# EAGLE design LAMPU_EMERGENCY_v1.3_all_module_smd (EAGLE 9.6.1)
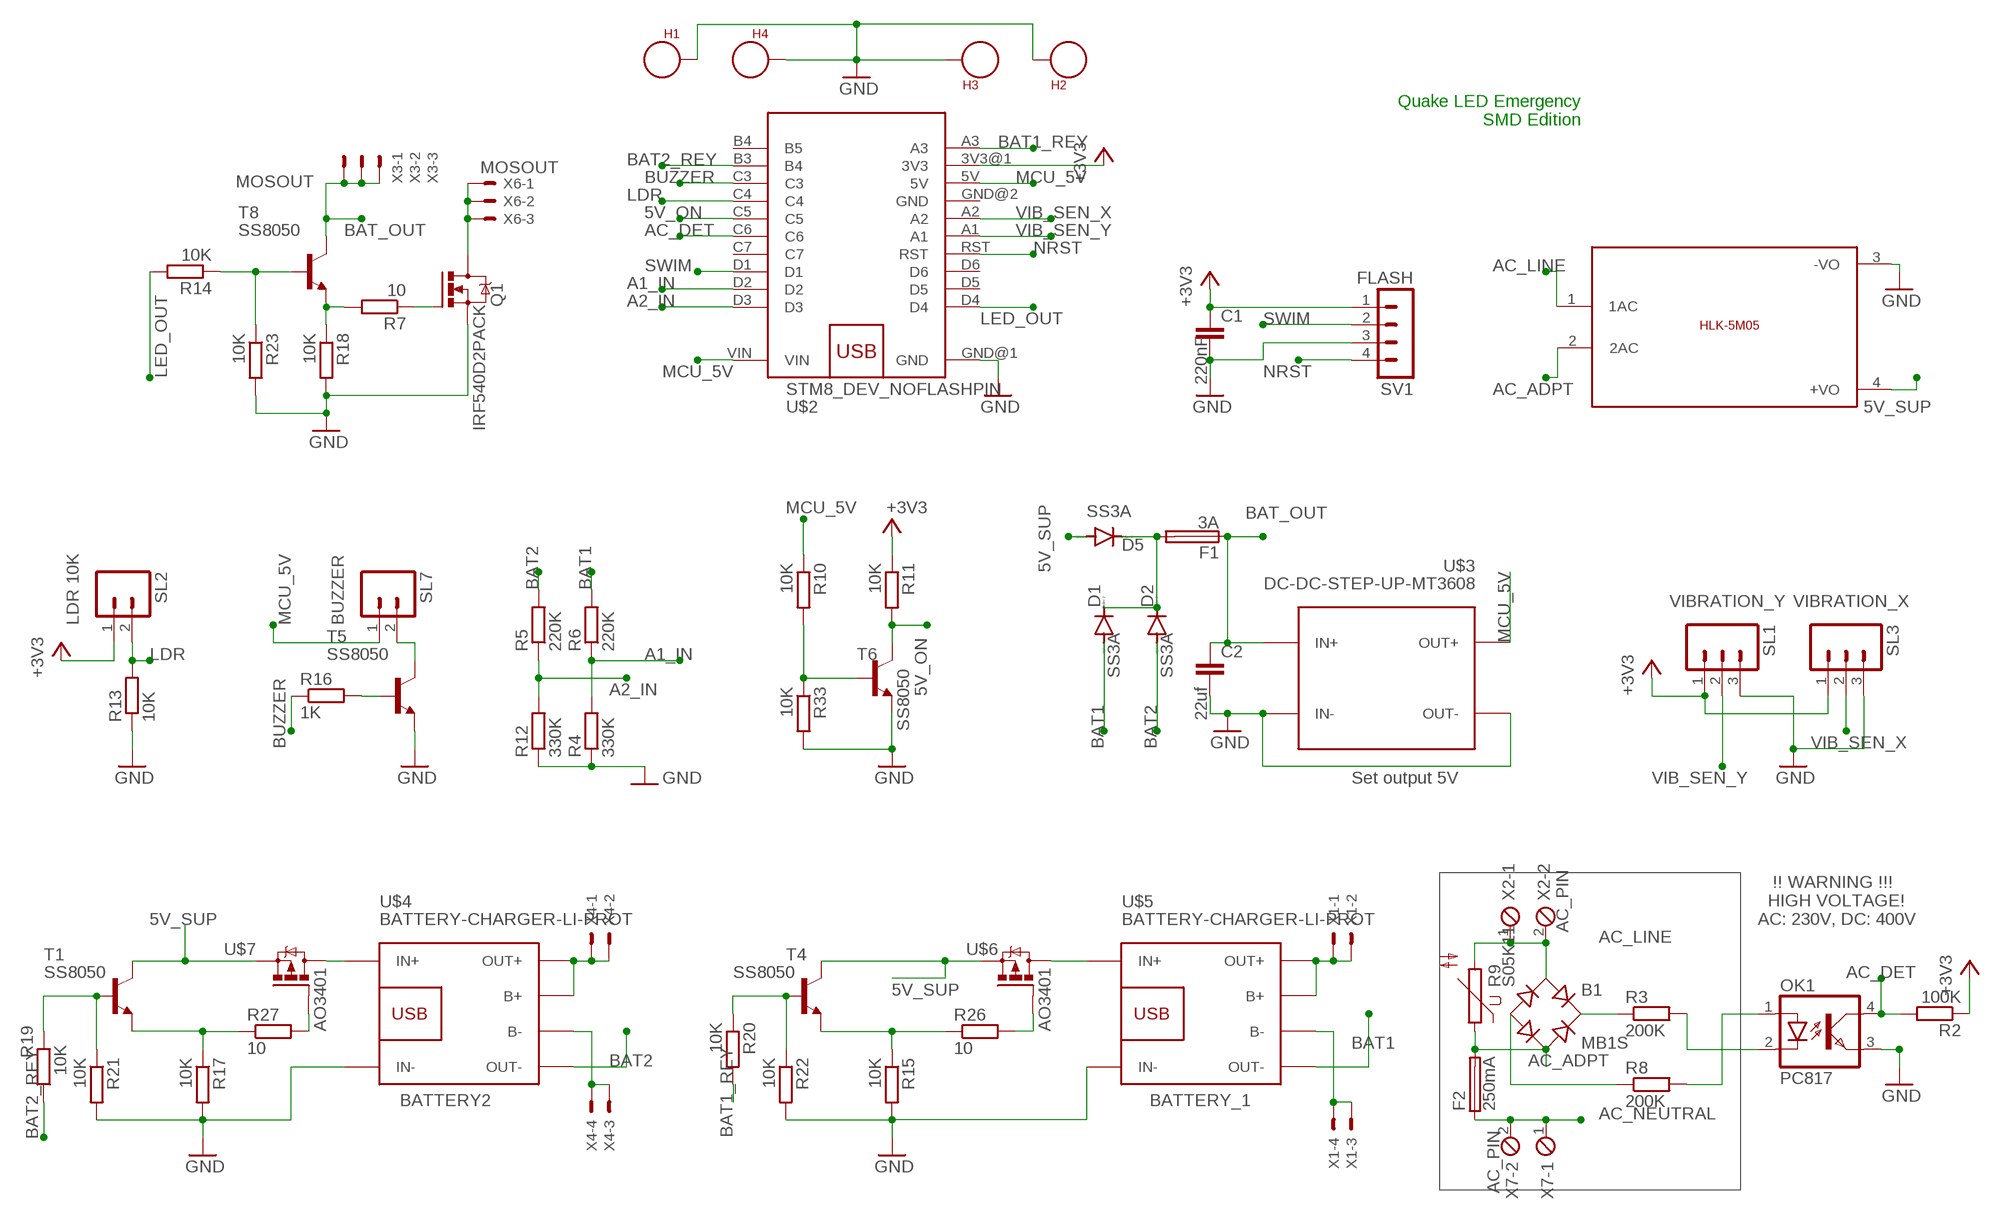
[diagram p0: schematic, sheet 1]

## Parts
B1  MB1S  [SOIC-4]
C1  220nF  C-EUC0805K  [C0805K]
C2  22uf  C-EUC0805K  [C0805K]
D1  SS3A  ES2D  [SMB]
D2  SS3A  ES2D  [SMB]
D5  SS3A  ES2D  [SMB]
F1  3A  FUSEGSH15  [GSH15]
F2  250mA  TR5  [TR5]
H1  SEW_HOLE  [SIMPLE_HOLE]
H2  SEW_HOLE  [SIMPLE_HOLE]
H3  SEW_HOLE  [SIMPLE_HOLE]
H4  SEW_HOLE  [SIMPLE_HOLE]
OK1  PC817  [DIL04]
Q1  IRF540D2PACK  [D2PACK]
R2  100K  R-EU_M1206  [M1206]
R3  200K  R-EU_0922V  [0922V]
R4  330K  R-EU_M1206  [M1206]
R5  220K  R-EU_M1206  [M1206]
R6  220K  R-EU_M1206  [M1206]
R7  10  R-EU_M1206  [M1206]
R8  200K  R-EU_0922V  [0922V]
R9  S05K11  [S05K11]
R10  10K  R-EU_M1206  [M1206]
R11  10K  R-EU_M1206  [M1206]
R12  330K  R-EU_M1206  [M1206]
R13  10K  R-EU_M1206  [M1206]
R14  10K  R-EU_M1206  [M1206]
R15  10K  R-EU_M1206  [M1206]
R16  1K  R-EU_M1206  [M1206]
R17  10K  R-EU_M1206  [M1206]
R18  10K  R-EU_M1206  [M1206]
R19  10K  R-EU_M1206  [M1206]
R20  10K  R-EU_M1206  [M1206]
R21  10K  R-EU_M1206  [M1206]
R22  10K  R-EU_M1206  [M1206]
R23  10K  R-EU_M1206  [M1206]
R26  10  R-EU_M1206  [M1206]
R27  10  R-EU_M1206  [M1206]
R33  10K  R-EU_M1206  [M1206]
SL1  VIBRATION_Y  M03  [03P]
SL2  LDR 10K  M02  [02P]
SL3  VIBRATION_X  M03  [03P]
SL7  BUZZER  M02  [02P]
SV1  FLASH  MA04-1  [MA04-1]
T1  SS8050  BC846  [SOT23]
T4  SS8050  BC846  [SOT23]
T5  SS8050  BC846  [SOT23]
T6  SS8050  BC846  [SOT23]
T8  SS8050  BC846  [SOT23]
U$1  5VDC/5W  HLK-5M05  [HLK-5M05]
U$2  STM8_DEV_NOFLASHPIN  [NO_FLASH_PIN]
U$3  DC-DC-STEP-UP-MT3608  [DC-DC-STEP-UP-MT3608]
U$4  BATTERY-CHARGER-LI-PROT  [BATTERY-CHARGER-LI-PROT]
U$5  BATTERY-CHARGER-LI-PROT  [BATTERY-CHARGER-LI-PROT]
U$6  AO3401  [SOT23]
U$7  AO3401  [SOT23]
X1  BATTERY_1  22-23-2041  [22-23-2041]
X2  AC_PIN  MPT2  [2POL254]
X3  MOSOUT  22-23-2031  [22-23-2031]
X4  BATTERY2  22-23-2041  [22-23-2041]
X6  MOSOUT  22-23-2031  [22-23-2031]
X7  AC_PIN  MPT2  [2POL254]

## Nets
5V_ON: R11.2 T6.3(C) U$2.C5
5V_SUP: D5.A T1.3(C) T4.3(C) U$1.4(+VO) U$6.3(S) U$7.3(S)
+3V3: C1.1 R2.1 R11.1 SL1.1 SL2.1 SL3.1 SV1.1 U$2.3V3@1(3V3)
A1_IN: R4.2 R6.1 U$2.D2
A2_IN: R5.1 R12.2 U$2.D3
AC_ADPT: B1.~2(AC2) F2.2 R9.1 U$1.2(2AC)
AC_DET: OK1.4(COL) R2.2 U$2.C6
AC_LINE: B1.~1(AC1) R9.2 U$1.1(1AC) X2.1 X2.2
AC_NEUTRAL: F2.1 X7.1 X7.2
BAT1: D1.A R6.2 U$5.OUT-
BAT1_REY: R20.2 U$2.A3
BAT2: D2.A R5.2 U$4.OUT-
BAT2_REY: R19.1 U$2.B3(B4)
BAT_OUT: C2.1 F1.1 T8.3(C) U$3.IN+ X3.1 X3.2 X3.3
BUZZER: R16.1 U$2.C3
GND: C1.2 C2.2 H1.P$1 H2.P$1 H3.P$1 H4.P$1 OK1.3(EMIT) Q1.3(S) R4.1 R12.1 R13.1 R15.2 R17.2 R18.2 R21.2 R22.2 R23.2 R33.2 SL1.3 SL3.3 SV1.3 T5.2(E) T6.2(E) U$1.3(-VO) U$2.GND@1(GND) U$3.IN- U$3.OUT- U$4.IN- U$5.IN-
LDR: R13.2 SL2.2 U$2.C4
LED_OUT: R14.2 U$2.D4
MCU_5V: R10.1 SL7.1 U$2.5V U$2.VIN U$3.OUT+
N$1: OK1.2(C) R3.2
N$2: R10.2 R33.1 T6.1(B)
N$3: B1.+ R3.1
N$4: B1.- R8.1
N$5: OK1.1(A) R8.2
N$6: U$4.B+ U$4.OUT+ X4.1 X4.2
N$8: Q1.1(G) R7.1
N$9: R26.2 U$6.1(G)
N$10: U$5.IN+ U$6.2(D)
N$11: U$4.B- X4.3 X4.4
N$13: U$5.B+ U$5.OUT+ X1.1 X1.2
N$14: R15.1 R26.1 T4.2(E)
N$15: SL7.2 T5.3(C)
N$16: R27.2 U$7.1(G)
N$17: D1.C D2.C D5.C F1.2
N$18: R16.2 T5.1(B)
N$19: U$5.B- X1.3 X1.4
N$20: R19.2 R21.1 T1.1(B)
N$21: R7.2 R18.1 T8.2(E)
N$23: R14.1 R23.1 T8.1(B)
N$24: Q1.2(D) X6.1 X6.2 X6.3
N$26: R17.1 R27.1 T1.2(E)
N$29: R20.1 R22.1 T4.1(B)
N$39: U$4.IN+ U$7.2(D)
NRST: SV1.4 U$2.RST
SWIM: SV1.2 U$2.D1
VIB_SEN_X: SL3.2 U$2.A2
VIB_SEN_Y: SL1.2 U$2.A1
Unconnected: U$2.B4(B5) U$2.C7 U$2.D5 U$2.D6

## Notes on the sheet
- Quake LED Emergency
         SMD Edition
- Set output 5V
- !! WARNING !!!
    HIGH VOLTAGE!
  AC: 230V, DC: 400V

## Power pins joined to a net without a drawn wire
GND: U$2.GND@2(GND)

## Library data of the parts
B1 = rectifier:MB*S: Bridge Rectifier Source: http://www.fairchildsemi.com/ds/MB/MB6S.pdf
C1 C2 = rcl:C-EU: CAPACITOR, European symbol; SPICEPREFIX: C
D1 D2 D5 = diode:ES2D: DIODE super fast rectifier, 2 A
F1 = fuse:FUSE: Fuse; OC_FARNELL: unknown; OC_NEWARK: unknown
F2 = fuse:TR5: FUSE Wickmann; OC_FARNELL: unknown; OC_NEWARK: unknown
H1-H4 = LilyPad-Wearables:SEW_HOLE: Simple sew-hole .1" diameter hole with 20mil annular ring
OK1 = optocoupler:PC817: SHARP OPTO COUPLER; MPN: PC817X4J000F; OC_FARNELL: 9707727; OC_NEWARK: 97K7059; SPICEPREFIX: O
Q1 = transistor-power:IRF540: HEXFET Power MOSFET
R2-R8 R10-R23 R26 R27 R33 = rcl:R-EU_: RESISTOR, European symbol; SPICEPREFIX: R
R9 = varistor:S05K11: VARISTOR
SL1 SL3 = con-amp-quick:M03: AMP QUICK CONNECTOR; OC_FARNELL: unknown; OC_NEWARK: unknown
SL2 SL7 = con-amp-quick:M02: AMP QUICK CONNECTOR; OC_FARNELL: unknown; OC_NEWARK: unknown
SV1 = con-lstb:MA04-1: PIN HEADER; OC_FARNELL: unknown; OC_NEWARK: unknown
T1 T4-T6 T8 = transistor:BC846: NPN TRANSISTOR
U$1 = HLK-5M05:HLK-5M05: HLK-5M05 is an 5Volt/5W smps developed by HI-LINK; SIZE: 23x38(mm)
U$2 = STM8-blue:STM8_DEV_NOFLASHPIN
U$3 = diy-modules:DC-DC-STEP-UP-MT3608: DC/DC Step-Up Regulator based on MT3608 chip MT3608 datasheet available here: https://www.olimex.com/Products/Breadboarding/BB-PWR-3608/resources/MT3608.pdf Click here to find device on ebay.com <http://www.ebay.com/sch/mt3608+module>
U$4 U$5 = diy-modules:BATTERY-CHARGER-LI-PROT: Lithium Battery 5V Charger with protection circuit More details available here: http://www.instructables.com/id/DIY-Lithium-ion-Battery-Charger/step4/TP4056-based-lithium-ion-battery-charger-module/ Click here to find device on ebay.com <http://www.ebay.com/sch/tp4056+charger+usb+protection>
U$6 U$7 = transistor-power:AO3401
X1 X4 = con-molex:22-23-2041: .100" (2.54mm) Center Header - 4 Pin; MF: MOLEX; MPN: 22-23-2041; OC_FARNELL: 1462920; OC_NEWARK: 38C0355
X2 X7 = con-phoenix-254:MPT2: PHOENIX CONNECTOR; OC_FARNELL: unknown; OC_NEWARK: unknown
X3 X6 = con-molex:22-23-2031: .100" (2.54mm) Center Header - 3 Pin; MF: MOLEX; MPN: 22-23-2031; OC_FARNELL: 1462950; OC_NEWARK: 30C0862

## Board
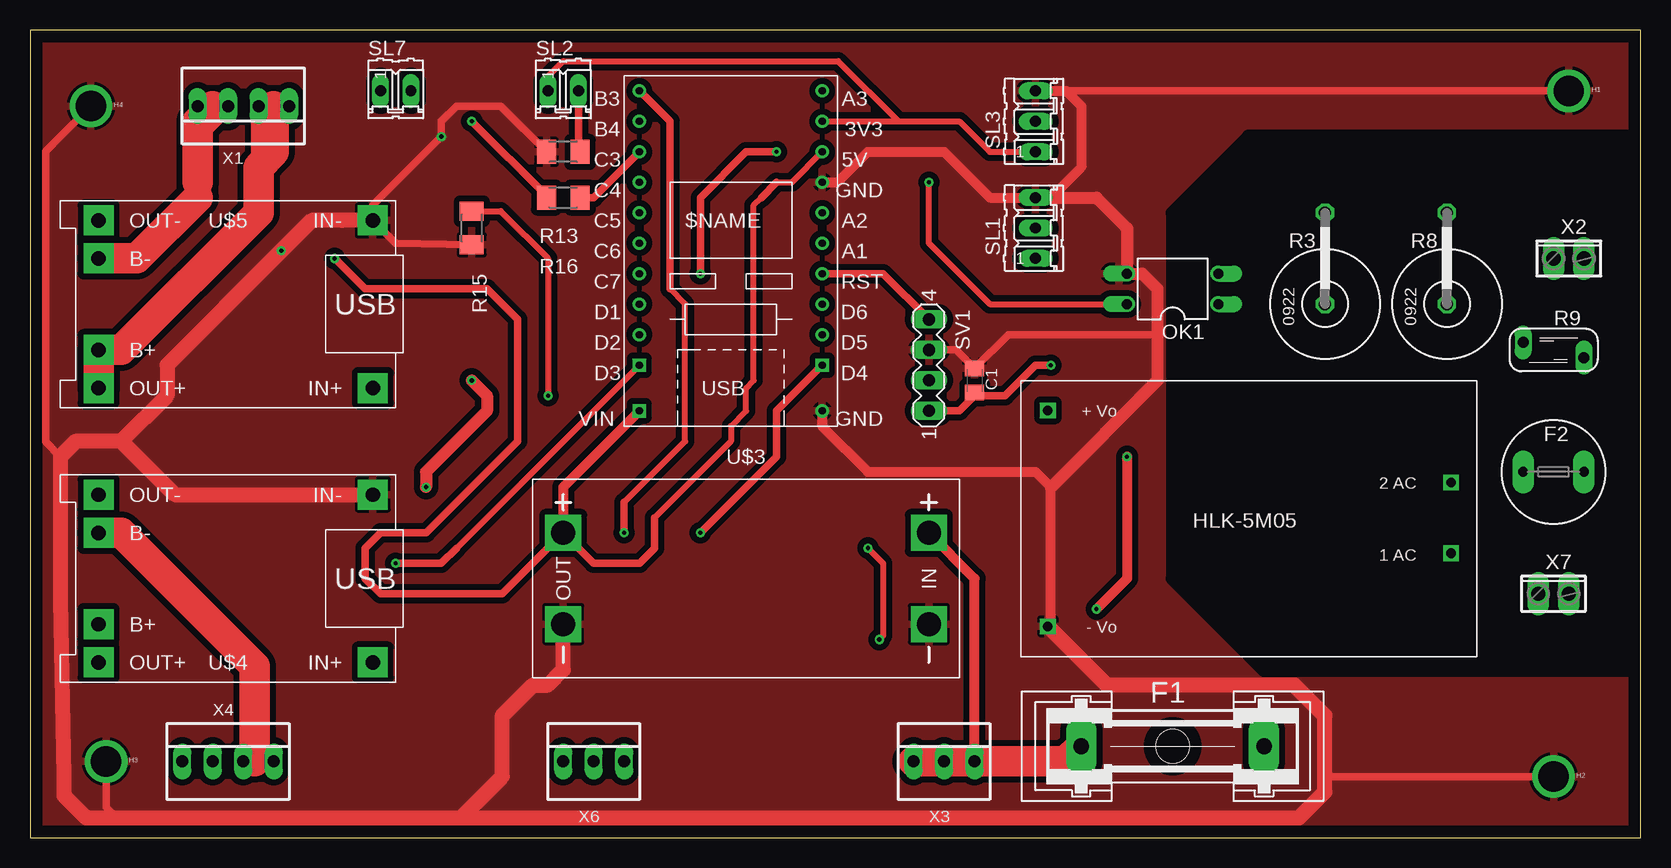
[diagram p1: board, top side]
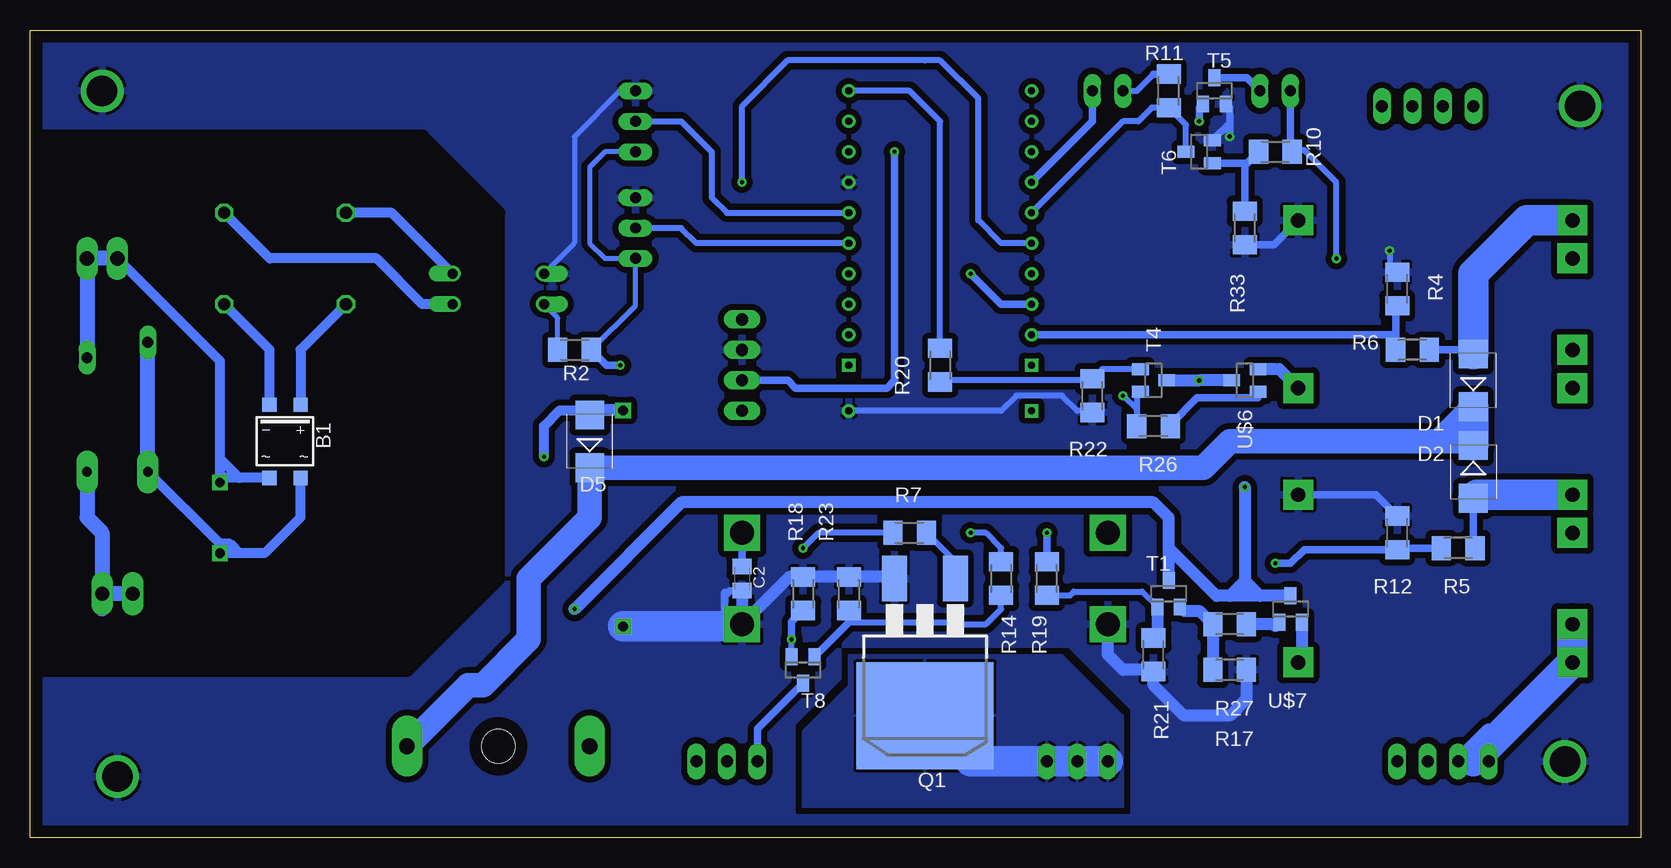
[diagram p2: board, bottom side, seen from below]

Size 134.29 x 67.3 mm. Coordinates in mm from the lower left corner, seen from the top.
Outline: 0,0 134.29,0 134.29,67.3 0,67.3 0,0
Copper layers (1*16): Top 0.035mm / dielectric 1.5mm / Bottom 0.035mm
Design rules "default": minimum track width 6mil, minimum drill 0.35mm, track to track 6mil, track to pad 6mil, pad to pad 6mil, via to via 6mil, smd to smd 6mil, copper to edge 40mil, drill to drill 6mil, minimum pad ring 10mil, minimum via ring 8mil, stop-mask expansion 4mil, vias tented up to drill 0mil, thermal gap 10mil
tRestrict: area 95.2,14 to 133.3,58.4
bRestrict: area 95.2,14 to 133.3,58.4

### Footprints (pad centres in the part's own frame; a part is rotated, then mirrored left to right if it is on the bottom)
SOIC-4 = smd 1.2 x 1.2: + 1.3,3.05; - -1.3,3.05; ~1 -1.3,-3.05; ~2 1.3,-3.05
C0805K = smd 1.3 x 1.6: 1 -1,0; 2 1,0
SMB = smd 2.4 x 2.4: A 2.2,0; C -2.2,0
GSH15 = drill 1.321 pad 2.54 long: 1 -7.62,0; 2 7.62,0 | hole 2.794: 0,0
TR5 = drill 0.813 pad 1.778 long: 1 -2.54,0; 2 2.54,0
SIMPLE_HOLE = drill 2.54 pad 3.048: P$1 0,0
DIL04 = drill 0.813 offset: 1 -1.27,-3.81; 2 1.27,-3.81; 3 1.27,3.81; 4 -1.27,3.81
D2PACK = smd 2.083 x 3.81: 1 -2.54,-8.89; 3 2.54,-8.89 | smd 11.43 x 8.89: 2 0,2.54
M1206 = smd 1.6 x 2: 1 -1.4,0; 2 1.4,0
0922V = drill 1.016 octagon: 1 -5.08,0; 2 2.54,0
S05K11 = drill 0.914 long: 1 -0.635,-2.54; 2 0.635,2.54
03P = drill 0.914 long: 1 -2.54,0; 2 0,0; 3 2.54,0
02P = drill 0.914 long: 1 -1.27,0; 2 1.27,0
MA04-1 = drill 1.016 long: 1 -3.81,0; 2 -1.27,0; 3 1.27,0; 4 3.81,0
SOT23 = smd 1 x 1.4: 1 -0.95,-1.1; 2 0.95,-1.1; 3 0,1.1
HLK-5M05 = drill 0.8 square: 1 -16.85,-2.93; 2 -16.85,2.97; 3 16.75,9.07; 4 16.75,-8.93
NO_FLASH_PIN = drill 0.6: 3V3@1 7.62,8.89; 5V 7.62,6.35; A1 7.62,-1.27; A2 7.62,1.27; A3 7.62,11.43; B3 -7.62,11.43; B4 -7.62,8.89; C3 -7.62,6.35; C4 -7.62,3.81; C5 -7.62,1.27; C6 -7.62,-1.27; C7 -7.62,-3.81; D1 -7.62,-6.35; D2 -7.62,-8.89; D5 7.62,-8.89; D6 7.62,-6.35; GND@1 7.62,3.81; GND@2 7.62,-15.24; RST 7.62,-3.81 | drill 0.6 square: D3 -7.62,-11.43; D4 7.62,-11.43; VIN -7.62,-15.24
DC-DC-STEP-UP-MT3608 = drill 2 pad 2.8 square: IN+ 15.24,3.81; IN- 15.24,-3.81; OUT+ -15.24,3.81; OUT- -15.24,-3.81
BATTERY-CHARGER-LI-PROT = drill 1.2 pad 2.5 square: B+ 10.795,3.81; B- 10.795,-3.81; IN+ -12.065,6.985; IN- -12.065,-6.985; OUT+ 10.795,6.985; OUT- 10.795,-6.985
22-23-2041 = drill 1 long: 1 -3.81,0; 2 -1.27,0; 3 1.27,0; 4 3.81,0
2POL254 = drill 1.2 long: 1 -1.27,0; 2 1.27,0
22-23-2031 = drill 1 long: 1 -2.54,0; 2 0,0; 3 2.54,0

### Placement (x,y rotation side)
B1  113.03,33.02 0 bottom
C1  78.74,38.1 90 top
C2  74.93,21.59 270 bottom
D1  13.97,38.1 90 bottom
D2  13.97,30.48 270 bottom
D5  87.63,33.02 90 bottom
F1  95.25,7.62 0 top
F2  127,30.48 180 top
H1  128.27,62.23 0 top
H2  127,5.08 0 top
H3  6.35,6.35 0 top
H4  5.08,60.96 0 top
OK1  95.25,45.72 90 top
Q1  59.69,12.7 180 bottom
R2  88.9,40.64 180 bottom
R3  107.95,49.53 90 top
R4  20.32,45.72 270 bottom
R5  15.24,24.13 0 bottom
R6  19.05,40.64 0 bottom
R7  60.96,25.4 180 bottom
R8  118.11,49.53 90 top
R9  127,40.64 270 top
R10  30.48,57.15 180 bottom
R11  39.37,62.23 270 bottom
R12  20.32,25.4 270 bottom
R13  44.45,57.15 0 top
R14  53.34,21.59 90 bottom
R15  36.83,50.8 270 top
R16  44.45,53.34 180 top
R17  34.29,13.97 0 bottom
R18  69.85,20.32 90 bottom
R19  49.53,21.59 270 bottom
R20  58.42,39.37 90 bottom
R21  40.64,15.24 270 bottom
R22  45.72,36.83 270 bottom
R23  66.04,20.32 90 bottom
R26  40.64,34.29 0 bottom
R27  34.29,17.78 0 bottom
R33  33.02,50.8 270 bottom
SL1  83.82,50.8 90 top
SL2  44.45,62.23 0 top
SL3  83.82,59.69 90 top
SL7  30.48,62.23 0 top
SV1  74.93,39.37 90 top
T1  39.37,20.32 0 bottom
T4  40.64,38.1 270 bottom
T5  35.56,62.23 0 bottom
T6  36.83,57.15 90 bottom
T8  69.85,13.97 180 bottom
U$1  101.6,26.67 180 top
U$2  58.42,50.8 0 top
U$3  59.69,21.59 0 top
U$4  16.51,21.59 180 top
U$5  16.51,44.45 180 top
U$6  33.02,38.1 90 bottom
U$7  29.21,19.05 0 bottom
X1  17.78,60.96 180 top
X2  128.27,48.26 0 top
X3  76.2,6.35 0 top
X4  16.51,6.35 0 top
X6  46.99,6.35 0 top
X7  127,20.32 0 top

### Tracks (layer width: path | path; a pad name or v marks a point on that pad's centre or on a via)
5V_ON
  Bottom 0.508: U$2.C5 43.18,59.69 41.91,59.69 40.77,60.83 R11.2 37.93,59.39 T6.3
5V_SUP  (via drill 0.35)
  Top 0.813: v91.44,31.75 91.44,21.59 v88.9,19.05
  Top 1.016: v36.83,38.1 38.1,36.83 38.1,35.56 33.02,30.48 v33.02,29.21
  Bottom 0.61: 87.59,35.6 87.25,35.6
  Bottom 0.813: 87.59,35.6 90.13,35.6 91.44,34.29 v91.44,31.75
  Bottom 1.016: U$1.4 87.25,35.6 D5.A | v88.9,19.05 80.01,27.94 40.64,27.94 39.37,26.67 39.37,24.13 | T1.3 39.37,24.13 | 33.02,20.32 33.02,21.42 | v33.02,29.21 33.02,21.42 | U$6.3 v36.83,38.1 T4.3 | U$7.3 31.75,20.15 | 31.75,20.15 34.29,20.15 | 34.29,20.15 35.39,20.15 39.37,24.13 | 31.75,20.15 33.02,21.42 | 33.02,21.42 34.29,20.15
+3V3  (via drill 0.35)
  Top 0.508: SL3.1 80.01,57.15 77.47,59.69 72.39,59.69 | U$2.3V3@1 72.39,59.69 | SL2.1 43.18,63.44 44.45,64.71 67.37,64.71 72.39,59.69
  Top 0.61: SV1.1 77.47,35.56 78.74,36.83 C1.1 79.01,36.83 81.28,36.83 83.82,39.37 v85.09,39.37
  Bottom 0.406: R2.1 83.82,44.32 SL1.1 86.36,48.26 87.63,49.53 87.63,55.88 86.36,57.15 SL3.1
  Bottom 0.508: SL2.1 42.04,62.23 40.64,63.63
  Bottom 0.61: 40.64,63.63 R11.1 | v85.09,39.37 86.23,39.37 R2.1
A1_IN
  Bottom 0.61: R4.2 20.45,44.19 20.45,41.91 | 20.45,41.91 R6.1 | 46.99,41.91 U$2.D2 20.45,41.91
A2_IN  (via drill 0.35)
  Top 0.508: 35.56,24.13 U$2.D3
  Top 0.61: v30.48,22.86 34.29,22.86 35.56,24.13
  Bottom 0.61: R5.1 20.32,24.13 R12.2 | R12.2 20.45,24.13 | R12.2 28.07,24 29.21,22.86 v30.48,22.86
AC_ADPT
  Bottom 0.813: B1.~2 111.76,29.94 111.76,26.67 114.73,23.7 116.84,23.7 | 116.84,23.7 U$1.2 118.45,24.47 | F2.2 118.45,24.47 | 116.84,23.7 117.61,24.47 118.45,24.47
  Bottom 1.27: F2.2 R9.1
AC_DET  (via drill 0.35)
  Top 0.508: OK1.4 80.01,44.45 74.93,49.53 v74.93,54.61
  Bottom 0.406: R2.2 90.3,43.31 OK1.4
  Bottom 0.508: U$2.C6 53.34,49.53 55.24,51.43 55.24,61.59 58.42,64.77 59.68,64.77 59.69,64.76 71.13,64.76 74.93,60.96 v74.93,54.61
AC_LINE
  Bottom 0.61: 121.53,42.78 121.92,43.18
  Bottom 0.813: B1.~1 116.84,29.97 | 116.84,29.97 118.08,29.97 U$1.1 118.45,31.58 | 118.45,31.58 118.45,39.71 121.92,43.18 X2.1 | 116.84,29.97 118.45,31.58
  Bottom 1.27: X2.1 X2.2 R9.2
AC_NEUTRAL
  Bottom 1.27: X7.2 128.27,19.05 | X7.1 X7.2 | F2.1 129.54,26.67 128.27,25.4 X7.2
BAT1
  Bottom 0.61: D1.A 14.31,40.64 R6.2
  Bottom 1.27: 14.31,39.71 D1.A
  Bottom 2.54: D1.A 13.97,46.99 9.52,51.43 U$5.OUT-
BAT1_REY
  Bottom 0.508: R20.2 58.42,59.69 60.96,62.23 U$2.A3
BAT2
  Bottom 0.61: D2.A 13.97,24.26 R5.2
  Bottom 2.54: U$4.OUT- 13.68,28.57 D2.A
BAT2_REY  (via drill 0.35)
  Top 0.508: 49.53,27.94 54.61,33.02 54.61,44.45 53.34,45.72
  Top 0.61: v49.53,25.4 49.53,27.94 | U$2.B3 53.34,59.69 53.34,45.72
  Bottom 0.61: R19.1 v49.53,25.4
BAT_OUT
  Top 0.813: X3.3 78.74,21.59 U$3.IN+
  Top 2.54: X3.1 X3.2 X3.3 86.36,6.35 F1.1
  Bottom 0.61: U$3.IN+ C2.1 | T8.3 73.66,9.06 X3.1
BUZZER
  Top 0.61: U$2.C3 46.99,53.34 R16.1
GND  (via drill 0.35)
  Top 0.61: R13.1 39.24,60.96 35.56,60.96 34.29,59.69 v34.29,58.42 28.57,52.7 U$5.IN- 30.48,49.53 R15.2 | H1.P$1 85.09,62.23 | H2.P$1 107.95,5.08 | H3.P$1 6.35,2.54 7.24,1.65 7.62,1.65 | H4.P$1 1.32,57.2 1.32,32.97 2.54,31.75 | SV1.3 77.2,40.64 C1.2 81.55,41.91 93.98,41.91
  Top 0.813: U$2.GND@1 67.31,54.61 69.85,57.15 76.2,57.15 78.74,54.61 80.01,53.34 SL1.3 85.09,53.34 87.63,55.88 87.63,60.96 86.36,62.23 85.09,62.23 SL3.3 | U$2.GND@2 66.04,34.29 69.85,30.48 83.82,30.48 85.09,29.21 85.09,17.84 U$1.3
  Top 1.016: SL1.3 88.9,53.34 91.44,50.8 OK1.3 92.71,46.99 93.98,45.72 93.98,41.91 93.98,38.1 85.09,29.21
  Top 1.27: 26.03,51.43 U$5.IN- 23.49,51.43 v20.95,48.89 11.43,39.37 11.43,36.83 7.62,33.02 | 35.94,1.65 39.37,5.08 39.37,10.16 41.91,12.7 43.18,12.7 44.45,13.97 U$3.OUT- | 7.62,33.02 3.81,33.02 2.54,31.75 2.54,19.83 2.82,5.09 2.82,3.53 4.7,1.65 7.62,1.65 35.94,1.65 | 7.62,33.02 12.06,28.57 U$4.IN- | U$1.3 89.75,12.7 105.41,12.7 107.95,10.16 107.95,5.08 107.95,3.81 105.79,1.65 35.94,1.65
  Bottom 0.406: OK1.3 88.9,49.53 88.9,58.42 85.09,62.23 SL3.3
  Bottom 0.508: R22.2 45.85,35.56 46.99,35.56 48.26,36.83 52.07,36.83 53.34,35.56 U$2.GND@2 | v20.95,48.89 20.95,47.75 R4.1
  Bottom 0.61: C2.2 75.93,20.59 76.2,20.32 76.34,20.45 76.38,20.41 76.38,17.6 | R12.1 22.09,28.57 U$4.IN- | R33.2 30.61,49.4 U$5.IN- | T5.2 34.29,60.81 34.29,59.54 | T6.2 34.29,59.54 | 34.29,59.54 v34.29,58.42
  Bottom 1.016: 76.38,17.6 75.11,17.6 U$3.IN- | Q1.3 62.36,21.72 R23.2 R18.2 70.99,21.72 U$3.IN- | C2.2 U$3.IN- | U$3.OUT- 44.45,15.24 43.18,13.97 40.77,13.97 R21.2 40.64,12.7 38.1,10.16 34.29,10.16 32.89,11.56 R17.2
  Bottom 2.54: U$1.3 75.11,17.6
  pour Top (isolate 0.508, rank 6): -5.08,69.85 -5.08,-6.35 138.43,-6.35 138.43,71.12 -5.08,71.12
  pour Bottom (isolate 0.508, rank 6): -6.35,72.39 -6.35,-7.62 -7.62,-8.89 139.7,-8.89 139.7,73.66 -5.08,73.66
LDR
  Top 0.61: R13.2 45.72,57.28 SL2.2
  Bottom 0.61: U$2.C4 45.72,59.69 SL2.2
LED_OUT  (via drill 0.35)
  Top 0.61: v55.88,25.4 62.23,31.75 62.23,35.56 U$2.D4
  Bottom 0.508: R14.2 53.34,24.13 54.61,25.4 v55.88,25.4
MCU_5V  (via drill 0.35)
  Top 0.508: 52.07,26.67 58.42,33.02 58.42,34.29 59.69,35.56 59.69,37.46 60.33,38.1 60.33,52.7 60.96,53.34 | U$2.5V 63.5,54.61 62.23,54.61
  Top 0.61: 44.45,26.67 U$3.OUT+ | v25.4,48.26 27.94,45.72 38.1,45.72 40.64,43.18 40.64,33.02 33.02,25.4 29.21,25.4 27.94,24.13 27.94,21.59 29.21,20.32 39.37,20.32 U$3.OUT+ | 62.23,54.61 60.96,53.34 | U$3.OUT+ 46.99,22.86 50.8,22.86 52.07,24.13 52.07,26.67
  Top 0.813: U$2.VIN 44.45,29.21 44.45,26.67
  Bottom 0.508: v25.4,48.26 25.4,54.61 28.07,57.28 29.21,57.28
  Bottom 0.61: SL7.1 29.21,57.28 R10.1
N$1
  Bottom 0.813: OK1.2 104.14,52.07 R3.2
N$2
  Bottom 0.61: T6.1 32.83,56.2 R10.2 33.02,56.01 R33.1
N$3
  Bottom 0.813: R3.1 111.73,40.67 B1.+
N$4
  Bottom 0.813: B1.- 114.33,40.67 R8.1
N$5
  Bottom 0.813: OK1.1 101.6,44.45 105.41,48.26 114.3,48.26 R8.2
N$6
  Bottom 1.27: 13.97,6.35 X4.1 12.7,7.62 | U$4.OUT+ 12.7,7.62 | 12.7,7.62 12.7,8.89 X4.2 13.97,6.35 | 12.7,7.62 13.97,6.35
  Bottom 2.54: U$4.B+ U$4.OUT+ 13.97,6.35
N$8
  Bottom 0.508: Q1.1 57.15,22.99 R7.1
N$9
  Bottom 0.508: U$6.1 31.92,36.66
  Bottom 0.61: 31.92,36.66 37,36.66 39.24,34.42 R26.2
N$10
  Bottom 0.61: 30.16,39.05 30.48,39.05
  Bottom 1.016: U$5.IN+ 30.16,39.05 | 30.48,39.05 U$6.2
N$11
  Top 1.27: X4.3 X4.4 19.05,7.62 18.73,7.62 18.73,7.3 X4.3
  Top 2.54: U$4.B- 7.62,25.4 18.73,14.29 18.73,8.89 18.73,7.62 18.73,6.35
N$13
  Top 1.27: 19.05,53.98 19.05,58.42 | 19.05,58.42 X1.2 20.32,60.96 X1.1 19.05,58.42
  Top 2.54: U$5.OUT+ U$5.B+ 7.62,40.64 19.05,52.07 19.05,53.98 19.05,55.88 20.32,57.15 20.32,60.96
N$14  (via drill 0.35)
  Top 0.508: R15.1 39.24,52.2 39.37,52.07 43.18,48.26 v43.18,36.83
  Bottom 0.508: T4.2 42.04,36.85 42.04,35.69 | R26.1 42.04,35.56 42.04,35.69 | v43.18,36.83 42.04,35.69
N$15
  Bottom 0.61: SL7.2 32.85,63.33 T5.3
N$16
  Bottom 1.016: U$7.1 30.46,17.65 30.83,17.78 R27.2
N$17
  Bottom 2.032: 16.51,33.02 34.29,33.02 36.49,30.82 D5.C 87.63,26.67 92.71,21.59 92.71,16.51 96.52,12.7 97.79,12.7 F1.2 | 16.51,33.02 14.31,33.02 D2.C | D1.C 16.51,33.36 16.51,33.02
  Bottom 2.54: 14.31,33.02 D2.C D1.C
N$18  (via drill 0.35)
  Top 0.61: v36.83,59.69 43.05,53.47 R16.2
  Bottom 0.61: T5.1 36.83,60.81 v36.83,59.69
N$19
  Top 1.27: 13.97,53.34 13.97,54.61 13.97,58.42 | 13.97,58.42 X1.4 15.24,60.96 X1.3 13.97,58.42
  Top 2.54: U$5.B- 8.89,48.26 13.97,53.34 | 13.97,54.61 13.97,59.69 15.24,60.96
N$20
  Bottom 0.508: R19.2 47.59,20.19 47.29,20.49 41.59,20.49 T1.1
  Bottom 1.016: T1.1 40.32,16.96 R21.1
N$21  (via drill 0.35)
  Top 0.508: v69.85,24.13 71.12,22.86 71.12,16.83 v70.8,16.51
  Bottom 0.508: R7.2 68.58,25.4 v69.85,24.13 | T8.2 v70.8,16.51
  Bottom 0.61: v70.8,16.51 70.8,17.97 R18.1
N$23
  Bottom 0.508: 66.04,17.93 57.3,17.93 57.15,17.78 54.61,17.78 53.34,19.05 R14.1
  Bottom 0.61: R23.1 66.04,17.93 T8.1
N$24
  Bottom 2.54: X6.1 X6.2 X6.3 55.88,6.35 Q1.2
  pour Bottom (isolate 0.813): 48.26,15.24 43.18,10.16 43.18,2.54 69.85,2.54 69.85,8.89 66.04,12.7 66.04,15.24
N$26
  Bottom 1.016: T1.2 38.1,18.9 36.83,18.9 R27.1 35.69,14.1 35.56,13.97 R17.1
N$29
  Bottom 0.508: T4.1 44.9,39.05 R22.1 45.85,38.1 58.29,38.1 R20.1
N$39
  Bottom 1.016: U$4.IN+ 28.26,14.92 U$7.2
NRST
  Top 0.61: SV1.4 71.12,46.99 U$2.RST
SWIM  (via drill 0.35)
  Top 0.61: v62.23,57.15 59.69,57.15 55.88,53.34 v55.88,46.99
  Bottom 0.61: SV1.2 71.12,38.1 70.48,37.46 62.86,37.46 62.23,38.1 v62.23,57.15 | v55.88,46.99 53.34,44.45 U$2.D1
VIB_SEN_X
  Bottom 0.508: U$2.A2 76.2,52.07 77.47,53.34 77.47,57.15 80.01,59.69 SL3.2
VIB_SEN_Y
  Bottom 0.406: 82.55,50.8 SL1.2
  Bottom 0.508: SL1.2 80.01,50.8 78.74,49.53 U$2.A1